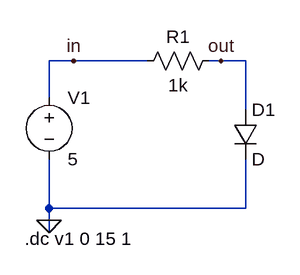
[diagram p0: schematic Draft 2.asc]
Draft 2.asc, the LTspice schematic file:
Version 4.1
SHEET 1 880 680
WIRE -384 -16 -416 -16
WIRE -288 -16 -384 -16
WIRE -192 -16 -208 -16
WIRE -160 -16 -192 -16
WIRE -416 32 -416 -16
WIRE -160 48 -160 -16
WIRE -416 176 -416 112
WIRE -160 176 -160 112
WIRE -160 176 -416 176
WIRE -416 192 -416 176
WIRE -416 208 -416 192
FLAG -416 192 0
FLAG -384 -16 in
FLAG -192 -16 out
SYMBOL voltage -416 16 R0
SYMATTR InstName V1
SYMATTR Value 5
SYMBOL res -192 -32 R90
WINDOW 0 0 56 VBottom 2
WINDOW 3 32 56 VTop 2
SYMATTR InstName R1
SYMATTR Value 1k
SYMBOL diode -176 48 R0
SYMATTR InstName D1
TEXT -448 216 Left 2 !.dc v1 0 15 1

The netlist it stands for:
* Draft 2.asc
V1 in 0 5
R1 out in 1k
D1 out 0 D
.model D D
.lib standard.dio
.dc v1 0 15 1
.backanno
.end